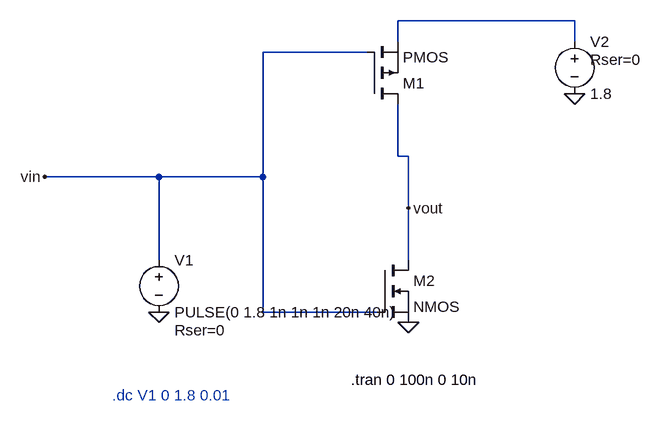
[diagram p0: schematic exp2.asc]
exp2.asc, the LTspice schematic file:
Version 4
SHEET 1 896 680
WIRE 784 -240 512 -240
WIRE 512 -208 512 -240
WIRE 784 -208 784 -240
WIRE 464 -192 304 -192
WIRE 512 -32 512 -112
WIRE 528 -32 512 -32
WIRE 144 0 -32 0
WIRE 304 0 304 -192
WIRE 304 0 144 0
WIRE 528 48 528 -32
WIRE 144 128 144 0
WIRE 528 128 528 48
WIRE 304 208 304 0
WIRE 480 208 304 208
FLAG 784 -128 0
FLAG 528 48 vout
FLAG -32 0 vin
FLAG 144 208 0
FLAG 528 224 0
SYMBOL voltage 144 112 R0
WINDOW 123 0 0 Left 0
WINDOW 39 24 124 Left 2
SYMATTR SpiceLine Rser=0
SYMATTR InstName V1
SYMATTR Value PULSE(0 1.8 1n 1n 1n 20n 40n)
SYMBOL pmos 464 -112 M180
SYMATTR InstName M1
SYMBOL nmos 480 128 R0
SYMATTR InstName M2
SYMBOL voltage 784 -224 R0
WINDOW 123 0 0 Left 0
WINDOW 39 24 44 Left 2
SYMATTR SpiceLine Rser=0
SYMATTR InstName V2
SYMATTR Value 1.8
TEXT 72 336 Left 2 ;.dc V1 0 1.8 0.01
TEXT 440 312 Left 2 !.tran 0 100n 0 10n

The netlist it stands for:
* exp2.asc
V1 vin 0 PULSE(0 1.8 1n 1n 1n 20n 40n) Rser=0
M1 vout vin N001 N001 PMOS
M2 vout vin 0 0 NMOS
V2 N001 0 1.8 Rser=0
.model NMOS NMOS
.model PMOS PMOS
.lib standard.mos
* .dc V1 0 1.8 0.01
.tran 0 100n 0 10n
.backanno
.end